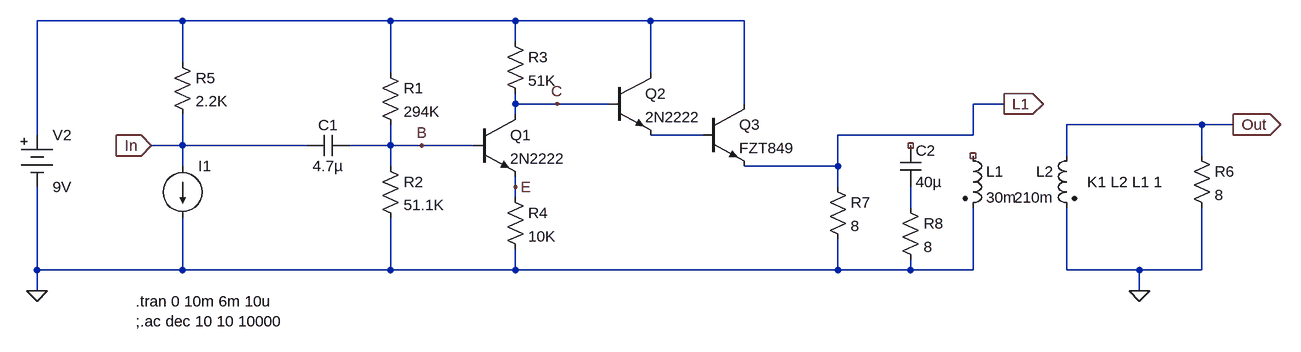
[diagram p0: schematic Audio Amp.asc]
Audio Amp.asc, the LTspice schematic file:
Version 4
SHEET 1 1716 680
WIRE 0 -32 -224 -32
WIRE 320 -32 0 -32
WIRE 512 -32 320 -32
WIRE 720 -32 512 -32
WIRE 864 -32 720 -32
WIRE 512 0 512 -32
WIRE 0 32 0 -32
WIRE 320 48 320 -32
WIRE 720 48 720 -32
WIRE 512 96 512 80
WIRE 576 96 512 96
WIRE 656 96 576 96
WIRE 864 96 864 -32
WIRE 1264 96 1216 96
WIRE 512 112 512 96
WIRE 1568 128 1360 128
WIRE 1616 128 1568 128
WIRE -224 144 -224 -32
WIRE 800 144 720 144
WIRE 1216 144 1216 96
WIRE 1216 144 1008 144
WIRE 0 160 0 112
WIRE 0 160 -48 160
WIRE 192 160 0 160
WIRE 320 160 320 128
WIRE 320 160 256 160
WIRE 368 160 320 160
WIRE 448 160 368 160
WIRE 1360 176 1360 128
WIRE 1568 176 1568 128
WIRE 0 192 0 160
WIRE 320 192 320 160
WIRE 1008 192 1008 144
WIRE 1008 192 864 192
WIRE 512 224 512 208
WIRE 1008 224 1008 192
WIRE 512 240 512 224
WIRE 1120 256 1120 224
WIRE -224 352 -224 224
WIRE 0 352 0 272
WIRE 0 352 -224 352
WIRE 320 352 320 272
WIRE 320 352 0 352
WIRE 512 352 512 320
WIRE 512 352 320 352
WIRE 1008 352 1008 304
WIRE 1008 352 512 352
WIRE 1120 352 1120 336
WIRE 1120 352 1008 352
WIRE 1216 352 1216 256
WIRE 1216 352 1120 352
WIRE 1360 352 1360 256
WIRE 1472 352 1360 352
WIRE 1568 352 1568 256
WIRE 1568 352 1472 352
WIRE -224 384 -224 352
WIRE 1472 384 1472 352
FLAG -224 384 0
FLAG 1264 96 L1
IOPIN 1264 96 Out
FLAG -48 160 In
IOPIN -48 160 In
FLAG 368 160 B
FLAG 1472 384 0
FLAG 1616 128 Out
IOPIN 1616 128 Out
FLAG 512 224 E
FLAG 576 96 C
SYMBOL cap 256 144 R90
WINDOW 0 0 32 VBottom 2
WINDOW 3 32 32 VTop 2
SYMATTR InstName C1
SYMATTR Value 4.7µ
SYMATTR SpiceLine V=50 Irms=0 Rser=0.004 Lser=0 mfg="TDK" pn="C575OX7RIH475M" type="X7R"
SYMBOL res 304 32 R0
SYMATTR InstName R1
SYMATTR Value 294K
SYMATTR SpiceLine tol=1 pwr=0.1
SYMBOL res 304 176 R0
SYMATTR InstName R2
SYMATTR Value 51.1K
SYMATTR SpiceLine tol=1 pwr=0.1
SYMBOL Misc\\battery -224 128 R0
WINDOW 123 0 0 Left 0
WINDOW 39 0 0 Left 0
SYMATTR InstName V2
SYMATTR Value 9V
SYMBOL npn 448 112 R0
SYMATTR InstName Q1
SYMATTR Value 2N2222
SYMBOL res 496 -16 R0
SYMATTR InstName R3
SYMATTR Value 51K
SYMATTR SpiceLine tol=1 pwr=0.1
SYMBOL res 496 224 R0
SYMATTR InstName R4
SYMATTR Value 10K
SYMATTR SpiceLine tol=1 pwr=0.1
SYMBOL res -16 16 R0
SYMATTR InstName R5
SYMATTR Value 2.2K
SYMBOL ind2 1200 160 R0
SYMATTR InstName L1
SYMATTR Value 30m
SYMATTR Type ind
SYMATTR SpiceLine Ipk=0.5 Rser=.08 Rpar=0 Cpar=0
SYMBOL ind2 1376 160 M0
SYMATTR InstName L2
SYMATTR Value 210m
SYMATTR Type ind
SYMATTR SpiceLine Ipk=0.5 Rser=.08 Rpar=0 Cpar=0
SYMBOL res 1552 160 R0
SYMATTR InstName R6
SYMATTR Value 8
SYMBOL npn 656 48 R0
SYMATTR InstName Q2
SYMATTR Value 2N2222
SYMBOL res 992 208 R0
SYMATTR InstName R7
SYMATTR Value 8
SYMBOL res 1104 240 R0
SYMATTR InstName R8
SYMATTR Value 8
SYMBOL cap 1104 224 M180
WINDOW 0 24 56 Left 2
WINDOW 3 24 8 Left 2
SYMATTR InstName C2
SYMATTR Value 40µ
SYMATTR SpiceLine V=50 Irms=0 Rser=0.004 Lser=0
SYMBOL current 0 192 R0
WINDOW 3 24 80 Invisible 2
WINDOW 39 0 0 Left 0
SYMATTR InstName I1
SYMATTR Value SINE(0.3m 0.3m 1000)
SYMATTR Value2 AC 0.3m
SYMBOL npn 800 96 R0
SYMATTR InstName Q3
SYMATTR Value FZT849
TEXT -72 400 Left 2 !.tran 0 10m 6m 10u\n;.ac dec 10 10 10000
TEXT 1392 216 Left 2 !K1 L2 L1 1

The netlist it stands for:
* Audio Amp.asc
C1 B In 4.7µ V=50 Irms=0 Rser=0.004 Lser=0 mfg="TDK" pn="C575OX7RIH475M" type="X7R"
R1 N001 B 294K tol=1 pwr=0.1
R2 B 0 51.1K tol=1 pwr=0.1
V2 N001 0 9V
Q1 C B E 0 2N2222
R3 N001 C 51K tol=1 pwr=0.1
R4 E 0 10K tol=1 pwr=0.1
R5 N001 In 2.2K
L1 NC_01 0 30m Ipk=0.5 Rser=.08 Rpar=0 Cpar=0
L2 Out 0 210m Ipk=0.5 Rser=.08 Rpar=0 Cpar=0
R6 Out 0 8
Q2 N001 C N002 0 2N2222
R7 L1 0 8
R8 N003 0 8
C2 N003 NC_02 40µ V=50 Irms=0 Rser=0.004 Lser=0
I1 In 0 SINE(0.3m 0.3m 1000) AC 0.3m
Q3 N001 N002 L1 0 FZT849
.model NPN NPN
.model PNP PNP
.lib standard.bjt
.tran 0 10m 6m 10u
;.ac dec 10 10 10000
K1 L2 L1 1
.backanno
.end